# EAGLE design Joysticks_connection_unit (EAGLE 6.3)
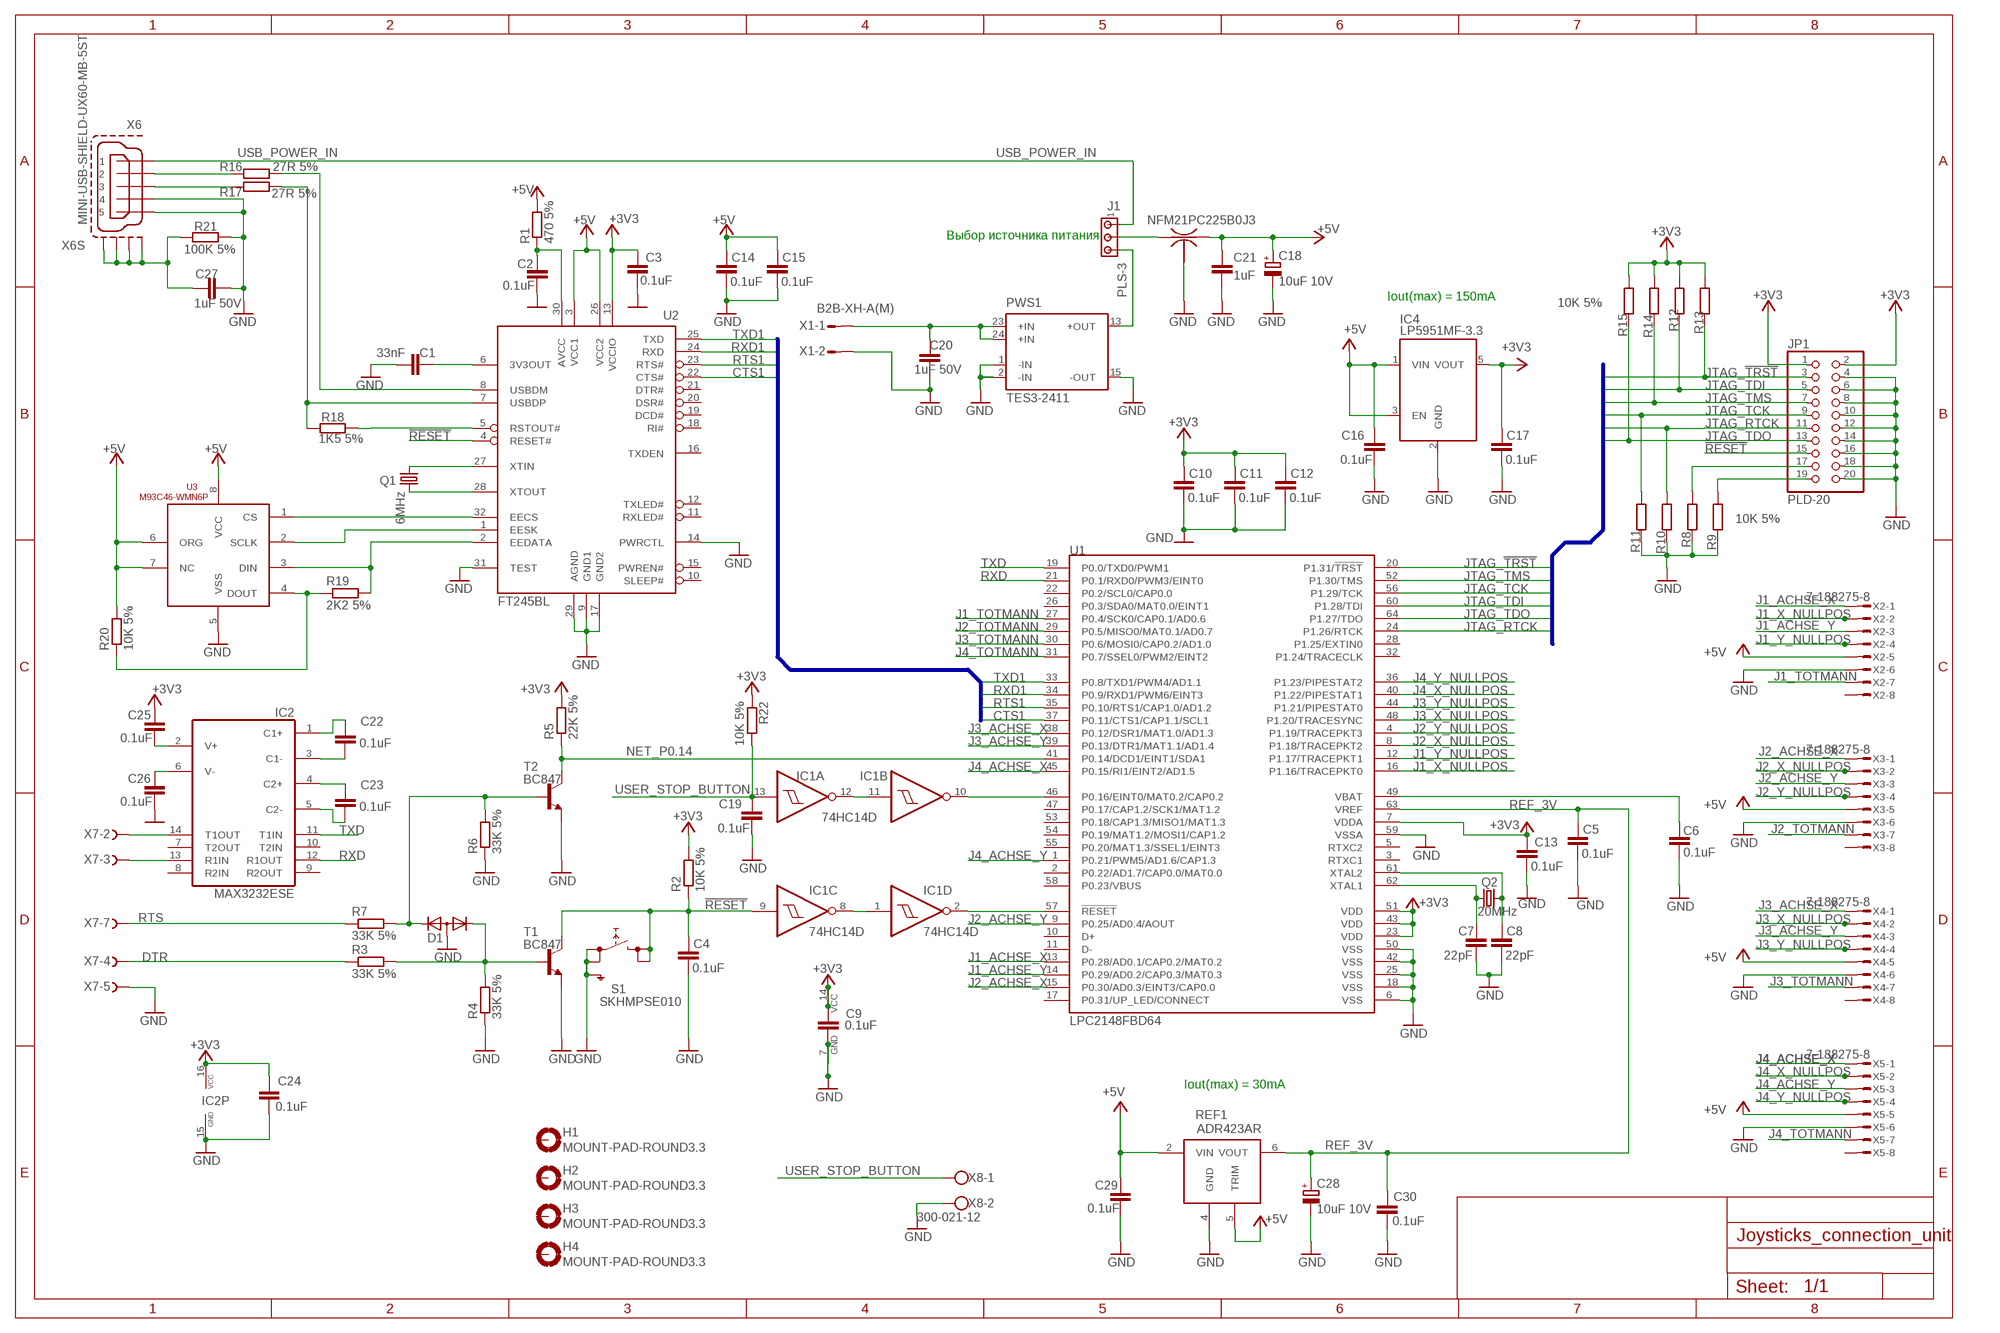
[diagram p0: schematic, sheet 1]

## Parts
C1  33nF  C-EUC0805  [C0805]
C2  0.1uF  C-EUC0805  [C0805]
C3  0.1uF  C-EUC0805  [C0805]
C4  0.1uF  C-EUC0805  [C0805]
C5  0.1uF  C-EUC0805  [C0805]
C6  0.1uF  C-EUC0805  [C0805]
C7  22pF  C-EUC0805  [C0805]
C8  22pF  C-EUC0805  [C0805]
C9  0.1uF  C-EUC0805  [C0805]
C10  0.1uF  C-EUC0805  [C0805]
C11  0.1uF  C-EUC0805  [C0805]
C12  0.1uF  C-EUC0805  [C0805]
C13  0.1uF  C-EUC0805  [C0805]
C14  0.1uF  C-EUC0805  [C0805]
C15  0.1uF  C-EUC0805  [C0805]
C16  0.1uF  C-EUC0805  [C0805]
C17  0.1uF  C-EUC0805  [C0805]
C18  10uF 10V  CPOL-EUSMCB  [SMC_B]
C19  0.1uF  C-EUC0805  [C0805]
C20  1uF 50V  C-EUC0805  [C0805]
C21  1uF  C-EUC0805  [C0805]
C22  0.1uF  C-EUC0805  [C0805]
C23  0.1uF  C-EUC0805  [C0805]
C24  0.1uF  C-EUC0805  [C0805]
C25  0.1uF  C-EUC0805  [C0805]
C26  0.1uF  C-EUC0805  [C0805]
C27  1uF 50V  C-EUC0805  [C0805]
C28  10uF 10V  CPOL-EUSMCB  [SMC_B]
C29  0.1uF  C-EUC0805  [C0805]
C30  0.1uF  C-EUC0805  [C0805]
CF1  NFM21PC225B0J3  NFM21C  [NFM21C]
D1  DIODE-2CA|ACSOT23  [SOT23]
H1  MOUNT-PAD-ROUND3.3  [3,3-PAD]
H2  MOUNT-PAD-ROUND3.3  [3,3-PAD]
H3  MOUNT-PAD-ROUND3.3  [3,3-PAD]
H4  MOUNT-PAD-ROUND3.3  [3,3-PAD]
IC1  74HC14D  [SO14]
IC2  MAX3232ESE  [SO16]
IC4  LP5951MF-3.3  [SOT23-5(MF05A)]
J1  PLS-3  MTA03-100  [10X03MTA]
JP1  PLD-20  PINHD-2X10  [2X10]
PWS1  TES3-2411  [TES3]
Q1  6MHz  CRYSTALHC49S  [HC49/S]
Q2  20MHz  CRYSTALHC49S  [HC49/S]
R1  470 5%  R-EU_R0805  [R0805]
R2  10K 5%  R-EU_R0805  [R0805]
R3  33K 5%  R-EU_R0805  [R0805]
R4  33K 5%  R-EU_R0805  [R0805]
R5  22K 5%  R-EU_R0805  [R0805]
R6  33K 5%  R-EU_R0805  [R0805]
R7  33K 5%  R-EU_R0805  [R0805]
R8  10K 5%  R-EU_R0805  [R0805]
R9  10K 5%  R-EU_R0805  [R0805]
R10  10K 5%  R-EU_R0805  [R0805]
R11  10K 5%  R-EU_R0805  [R0805]
R12  10K 5%  R-EU_R0805  [R0805]
R13  10K 5%  R-EU_R0805  [R0805]
R14  10K 5%  R-EU_R0805  [R0805]
R15  10K 5%  R-EU_R0805  [R0805]
R16  27R 5%  R-EU_R0805  [R0805]
R17  27R 5%  R-EU_R0805  [R0805]
R18  1K5 5%  R-EU_R0805  [R0805]
R19  2K2 5%  R-EU_R0805  [R0805]
R20  10K 5%  R-EU_R0805  [R0805]
R21  100K 5%  R-EU_R0805  [R0805]
R22  10K 5%  R-EU_R0805  [R0805]
REF1  ADR423AR  [SOIC8]
S1  SKHMPSE010  [SKHMPXE010]
T1  BC847  [SOT23]
T2  BC847  [SOT23]
U1  LPC2148FBD64  [TSQFP50P1200X1200X160-64N]
U2  FT245BL  [LQFP32]
U3  M93C46-WMN6P  [SO8]
X1  B2B-XH-A(M)  [B2B-XH-AM]
X2  7-188275-8  MICROMATCH-8SMF  [MMT-F-SMD-8]
X3  7-188275-8  MICROMATCH-8SMF  [MMT-F-SMD-8]
X4  7-188275-8  MICROMATCH-8SMF  [MMT-F-SMD-8]
X5  7-188275-8  MICROMATCH-8SMF  [MMT-F-SMD-8]
X6  MINI-USB-SHIELD-UX60-MB-5ST  [UX60-MB-5ST]
X7  F09VPS  [F09VP]
X8  300-021-12  W237-102  [W237-102]

## Nets
!RESET: C4.1 IC1.9(C:I) JP1.15 R2.1 S1.3(2.1) S1.4(2.2) T1.3(C) U2.4(RESET#)
+3V3: C3.1 C9.1 C10.1 C11.1 C12.1 C13.1 C17.1 C24.1 C25.1 IC1.14(P:VCC) IC2.16(VCC) IC4.5(VOUT) JP1.1 JP1.2 R2.2 R5.2 R12.2 R13.2 R14.2 R15.2 R22.1 U1.7(VDDA) U1.23(VDD) U1.43(VDD) U1.51(VDD) U2.13(VCCIO)
+5V: C14.1 C15.1 C16.1 C18.+ C21.1 C29.1 CF1.3 IC4.1(VIN) IC4.3(EN) R1.2 R20.2 REF1.2(VIN) REF1.5(TRIM) U2.3(VCC1) U2.26(VCC2) U3.6(ORG) U3.7(NC) U3.8(VCC) X2.5 X3.5 X4.5 X5.5
CTS1: U1.37(P0.11/CTS1/CAP1.1/SCL1) U2.22(CTS#)
DTR: R3.1 X7.4
GND: C1.2 C2.2 C3.2 C4.2 C5.2 C6.2 C7.2 C8.2 C9.2 C10.2 C11.2 C12.2 C13.2 C14.2 C15.2 C16.2 C17.2 C18.- C19.2 C20.2 C21.2 C24.2 C26.2 C27.2 C28.- C29.2 C30.2 CF1.2@1 D1.3(A) IC1.7(P:GND) IC2.15(GND) IC4.2(GND) JP1.4 JP1.6 JP1.8 JP1.10 JP1.12 JP1.14 JP1.16 JP1.18 JP1.20 PWS1.1(-IN) PWS1.2(-IN) PWS1.15(-OUT) R4.1 R6.1 R8.1 R9.1 R10.1 R11.1 R21.2 REF1.4(GND) S1.1(1.1) S1.2(1.2) S1.5(SH) T1.2(E) T2.2(E) U1.6(VSS) U1.18(VSS) U1.25(VSS) U1.42(VSS) U1.50(VSS) U1.59(VSSA) U2.9(GND1) U2.14(PWRCTL) U2.17(GND2) U2.29(AGND) U2.31(TEST) U3.5(VSS) X1.2 X2.6 X3.6 X4.6 X5.6 X6.4 X6.5 X7.5 X8.2
J1_ACHSE_X: U1.13(P0.28/AD0.1/CAP0.2/MAT0.2) X2.1
J1_ACHSE_Y: U1.14(P0.29/AD0.2/CAP0.3/MAT0.3) X2.3
J1_TOTMANN: U1.27(P0.4/SCK0/CAP0.1/AD0.6) X2.7
J1_X_NULLPOS: U1.16(P1.16/TRACEPKT0) X2.2
J1_Y_NULLPOS: U1.12(P1.17/TRACEPKT1) X2.4
J2_ACHSE_X: U1.15(P0.30/AD0.3/EINT3/CAP0.0) X3.1
J2_ACHSE_Y: U1.9(P0.25/AD0.4/AOUT) X3.3
J2_TOTMANN: U1.29(P0.5/MISO0/MAT0.1/AD0.7) X3.7
J2_X_NULLPOS: U1.8(P1.18/TRACEPKT2) X3.2
J2_Y_NULLPOS: U1.4(P1.19/TRACEPKT3) X3.4
J3_ACHSE_X: U1.38(P0.12/DSR1/MAT1.0/AD1.3) X4.1
J3_ACHSE_Y: U1.39(P0.13/DTR1/MAT1.1/AD1.4) X4.3
J3_TOTMANN: U1.30(P0.6/MOSI0/CAP0.2/AD1.0) X4.7
J3_X_NULLPOS: U1.48(P1.20/TRACESYNC) X4.2
J3_Y_NULLPOS: U1.44(P1.21/PIPESTAT0) X4.4
J4_ACHSE_X: U1.45(P0.15/RI1/EINT2/AD1.5) X5.1
J4_ACHSE_Y: U1.1(P0.21/PWM5/AD1.6/CAP1.3) X5.3
J4_TOTMANN: U1.31(P0.7/SSEL0/PWM2/EINT2) X5.7
J4_X_NULLPOS: U1.40(P1.22/PIPESTAT1) X5.2
J4_Y_NULLPOS: U1.36(P1.23/PIPESTAT2) X5.4
JTAG_!TRST: JP1.3 R13.1 U1.20(P1.31/!TRST)
JTAG_RTCK: JP1.11 R10.2 U1.24(P1.26/RTCK)
JTAG_TCK: JP1.9 R11.2 U1.56(P1.29/TCK)
JTAG_TDI: JP1.5 R12.1 U1.60(P1.28/TDI)
JTAG_TDO: JP1.13 R15.1 U1.64(P1.27/TDO)
JTAG_TMS: JP1.7 R14.1 U1.52(P1.30/TMS)
N$1: C2.1 R1.1 U2.30(AVCC)
N$2: C1.1 U2.6(3V3OUT)
N$3: IC1.1(D:I) IC1.8(C:O)
N$4: JP1.19 R9.2
N$5: C20.1 PWS1.23(+IN) PWS1.24(+IN) X1.1
N$6: C6.1 U1.49(VBAT)
N$7: D1.1(K1) R3.2 R4.2 T1.1(B)
N$8: JP1.17 R8.2
N$9: C7.1 Q2.1 U1.62(XTAL1)
N$10: C8.1 Q2.2 U1.61(XTAL2)
N$12: Q1.2 U2.28(XTOUT)
N$13: Q1.1 U2.27(XTIN)
N$14: R16.1 X6.2
N$15: R17.1 X6.3
N$16: R17.2 R18.1 U2.7(USBDP)
N$17: R16.2 U2.8(USBDM)
N$18: R18.2 U2.5(RSTOUT#)
N$19: U2.32(EECS) U3.1(CS)
N$20: U2.1(EESK) U3.2(SCLK)
N$21: R19.2 U2.2(EEDATA) U3.3(DIN)
N$22: R19.1 R20.1 U3.4(DOUT)
N$23: J1.3 PWS1.13(+OUT)
N$24: IC1.11(B:I) IC1.12(A:O)
N$26: IC1.2(D:O) U1.57(!RESET)
N$27: IC1.10(B:O) U1.46(P0.16/EINT0/MAT0.2/CAP0.2)
N$28: CF1.1 J1.2
N$29: C22.2 IC2.3(C1-)
N$30: C22.1 IC2.1(C1+)
N$31: C23.1 IC2.4(C2+)
N$32: C23.2 IC2.5(C2-)
N$33: C25.2 IC2.2(V+)
N$34: C26.1 IC2.6(V-)
N$35: IC2.14(T1OUT) X7.2
N$36: IC2.13(R1IN) X7.3
N$37: D1.2(K2) R6.2 R7.2 T2.1(B)
N$38: C27.1 R21.1 X6.M1(S1) X6.M2(S2) X6.M3(S3) X6.M4(S4)
NET_P0.14: R5.1 T2.3(C) U1.41(P0.14/DCD1/EINT1/SDA1)
REF_3V: C5.1 C28.+ C30.1 REF1.6(VOUT) U1.63(VREF)
RTS: R7.1 X7.7
RTS1: U1.35(P0.10/RTS1/CAP1.0/AD1.2) U2.23(RTS#)
RXD: IC2.12(R1OUT) U1.21(P0.1/RXD0/PWM3/EINT0)
RXD1: U1.34(P0.9/RXD1/PWM6/EINT3) U2.24(RXD)
TXD: IC2.11(T1IN) U1.19(P0.0/TXD0/PWM1)
TXD1: U1.33(P0.8/TXD1/PWM4/AD1.1) U2.25(TXD)
USB_POWER_IN: J1.1 X6.1
USER_STOP_BUTTON: C19.1 IC1.13(A:I) R22.2 X8.1
Unconnected: CF1.2@2 H1.B3,3(MOUNT) H2.B3,3(MOUNT) H3.B3,3(MOUNT) H4.B3,3(MOUNT) IC1.3(E:I) IC1.4(E:O) IC1.5(F:I) IC1.6(F:O) IC2.7(T2OUT) IC2.8(R2IN) IC2.9(R2OUT) IC2.10(T2IN) U1.2(P0.22/AD1.7/CAP0.0/MAT0.0) U1.3(RTXC1) U1.5(RTXC2) U1.10(D+) U1.11(D-) U1.17(P0.31/UP_LED/CONNECT) U1.22(P0.2/SCL0/CAP0.0) U1.26(P0.3/SDA0/MAT0.0/EINT1) U1.28(P1.25/EXTIN0) U1.32(P1.24/TRACECLK) U1.47(P0.17/CAP1.2/SCK1/MAT1.2) U1.53(P0.18/CAP1.3/MISO1/MAT1.3) U1.54(P0.19/MAT1.2/MOSI1/CAP1.2) U1.55(P0.20/MAT1.3/SSEL1/EINT3) U1.58(P0.23/VBUS) U2.10(SLEEP#) U2.11(RXLED#) U2.12(TXLED#) U2.15(PWREN#) U2.16(TXDEN) U2.18(RI#) U2.19(DCD#) U2.20(DSR#) U2.21(DTR#) X2.8 X3.8 X4.8 X5.8 X7.1 X7.6 X7.8 X7.9

## Buses
JTAG_TMS,JTAG_TCK,JTAG_!TRST,JTAG_TDI,JTAG_TDO,JTAG_RTCK
TXD1,RXD1,RTS1,CTS1

## Notes on the sheet
- Выбор источника питания
- Iout(max) = 150mA
- Iout(max) = 30mA

## Library data of the parts
C1-C17 C19-C27 C29 C30 = rcl:C-EU: CAPACITOR, European symbol
C18 C28 = rcl:CPOL-EU: POLARIZED CAPACITOR, European symbol
CF1 = murata-filter:NFM: EMIFIL(R) (Capacitor type) Single Circuit Type for Signal Lines Source: http://search.murata.co.jp/Ceramy/image/img/PDF/ENG/L0111S0109NFM3DC.pdf; MPN: NFM21CC102R1H3D; OC_FARNELL: 1828795; OC_NEWARK: 84R0165
D1 = diode:DIODE-2CA|AC: Dual DIODE Cathode-Anode|Anode-Cathode
H1-H4 = holes:MOUNT-PAD-ROUND: MOUNTING PAD, round
IC1 = 74xx-eu:74*14: Hex schmitt trigger INVERTER
IC2 = maxim:MAX3232*: True RS-232 Transceivers 3.0V to 5.5V, Low-Power up to 1Mbps, Using Four 0.1µF External Capacitors Source: http://pdfserv.maxim-ic.com/en/ds/MAX3222-MAX3241.pdf; MF: MAXIM; MPN: MAX3232ESE; OC_FARNELL: 9725539; OC_NEWARK: 79C3880
IC4 = my_components:LP5951MF-3.3: 150mA Low-Dropout CMOS Voltage Regulator Source: http://www.ti.com/lit/ds/symlink/lp5951.pdf
J1 = con-amp:MTA03-100: AMP connector
JP1 = pinhead:PINHD-2X10: PIN HEADER
PWS1 = traco-electronic:TES3: DC/DC Converter Single Output, 3W Source: Data sheet <http://www.tracopower.com/datasheet_g/tes3-d.pdf>
Q1 Q2 = crystal:CRYSTAL: CRYSTAL; OC_FARNELL: 1667008; OC_NEWARK: unknown
R1-R22 = rcl:R-EU_: RESISTOR, European symbol
REF1 = my_components:ADR423AR: Precision Micropower, Low Dropout, Voltage References Low self-supply current: 45 uA max Voltage Output: 3.0 Volts High Output Current: 30 mA Short Circuit Protection
S1 = switch:SKHMP*E010: 6.2 X 6.5mm TACT Switch (SMD) Source: http://www3.alps.co.jp/WebObjects/catalog.woa/PDF/E/Switch/Tact/SKHM/SKHM.PDF
T1 T2 = transistor:BC847: NPN TRANSISTOR
U1 = philips-5:LPC2148
U2 = ftdichip-5:FT245BL: USB FIFO 2nd Generation USB FIFO (USB <-> Parallel) Controller
U3 = my_components:M93C46-WMN6P: 1 Kbit MICROWIRE® serial access EEPROM http://www.st.com/internet/com/TECHNICAL_RESOURCES/TECHNICAL_LITERATURE/DATASHEET/CD00001142.pdf
X1 = my_components:B2B-XH-A(M): B2B-XH-A(M) Top entry type, 2.5 mm, 2 pin 1 row
X2-X5 = con-amp-micromatch:MICROMATCH-8: MicroMaTch 8 7-215464-8 / 0-215464-8 Drawing Number C-215464 DDEController.pdf
X6 = con-hirose:MINI-USB-SHIELD-: MINI USB Connector Source: http://www.hirose.co.jp/cataloge_hp/e24000019.pdf; OC_FARNELL: unknown; OC_NEWARK: unknown
X7 = con-subd:F09?S: SUB-D; OC_FARNELL: unknown; OC_NEWARK: unknown
X8 = con-wago-500:W237-102: WAGO SCREW CLAMP; MPN: 237-102; OC_FARNELL: unknown; OC_NEWARK: 70K9898

## Board
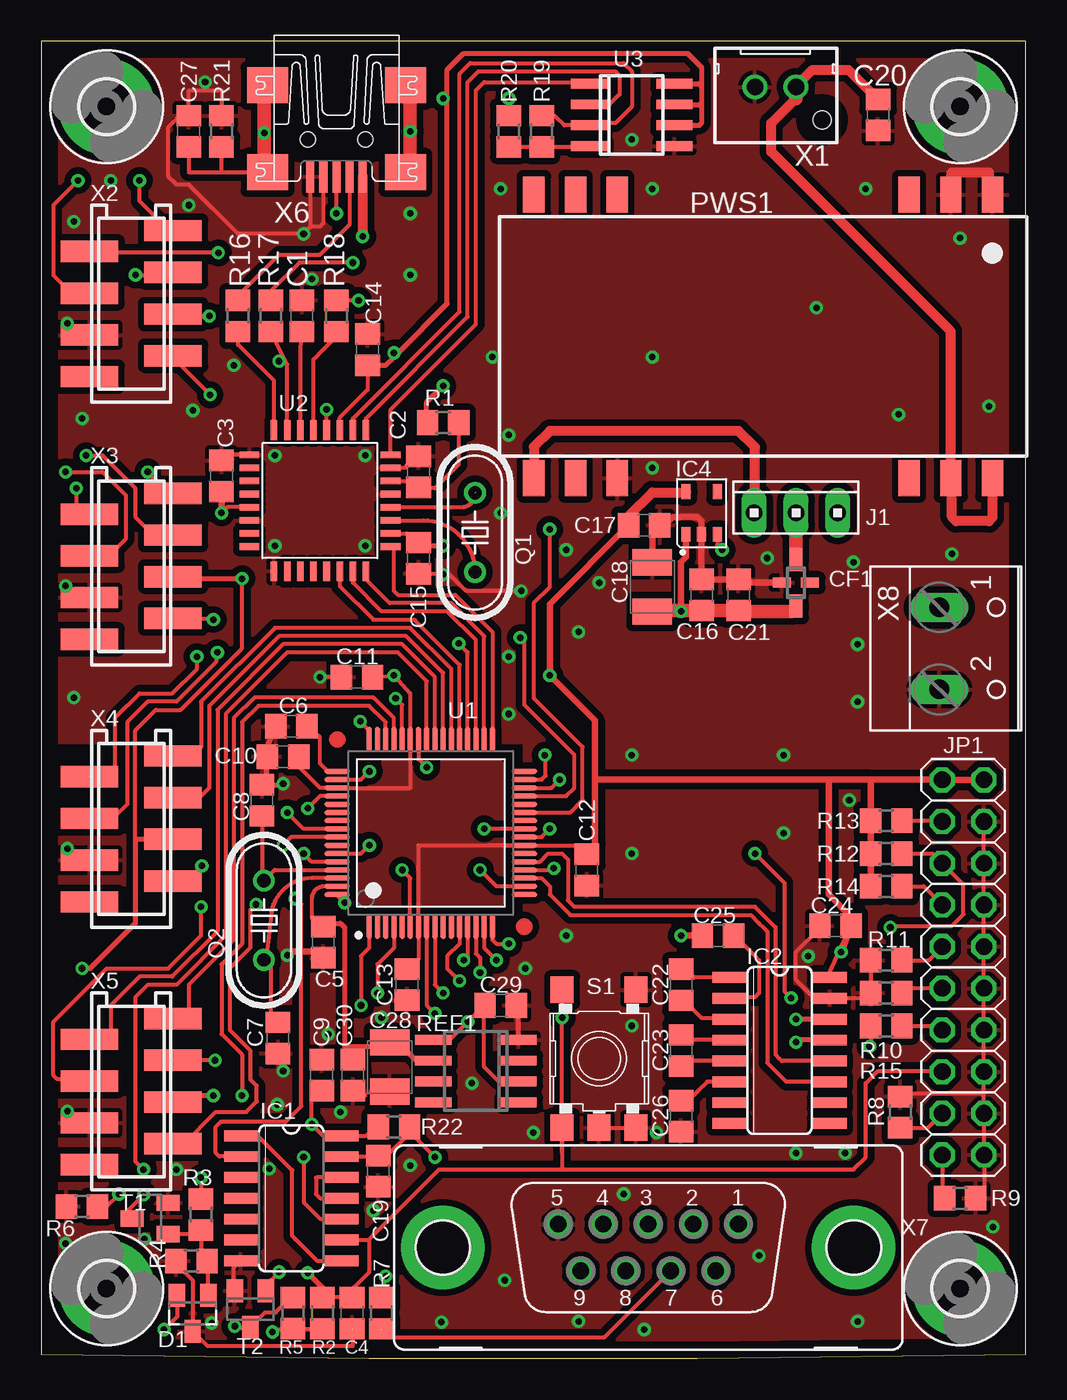
[diagram p1: board, top side]
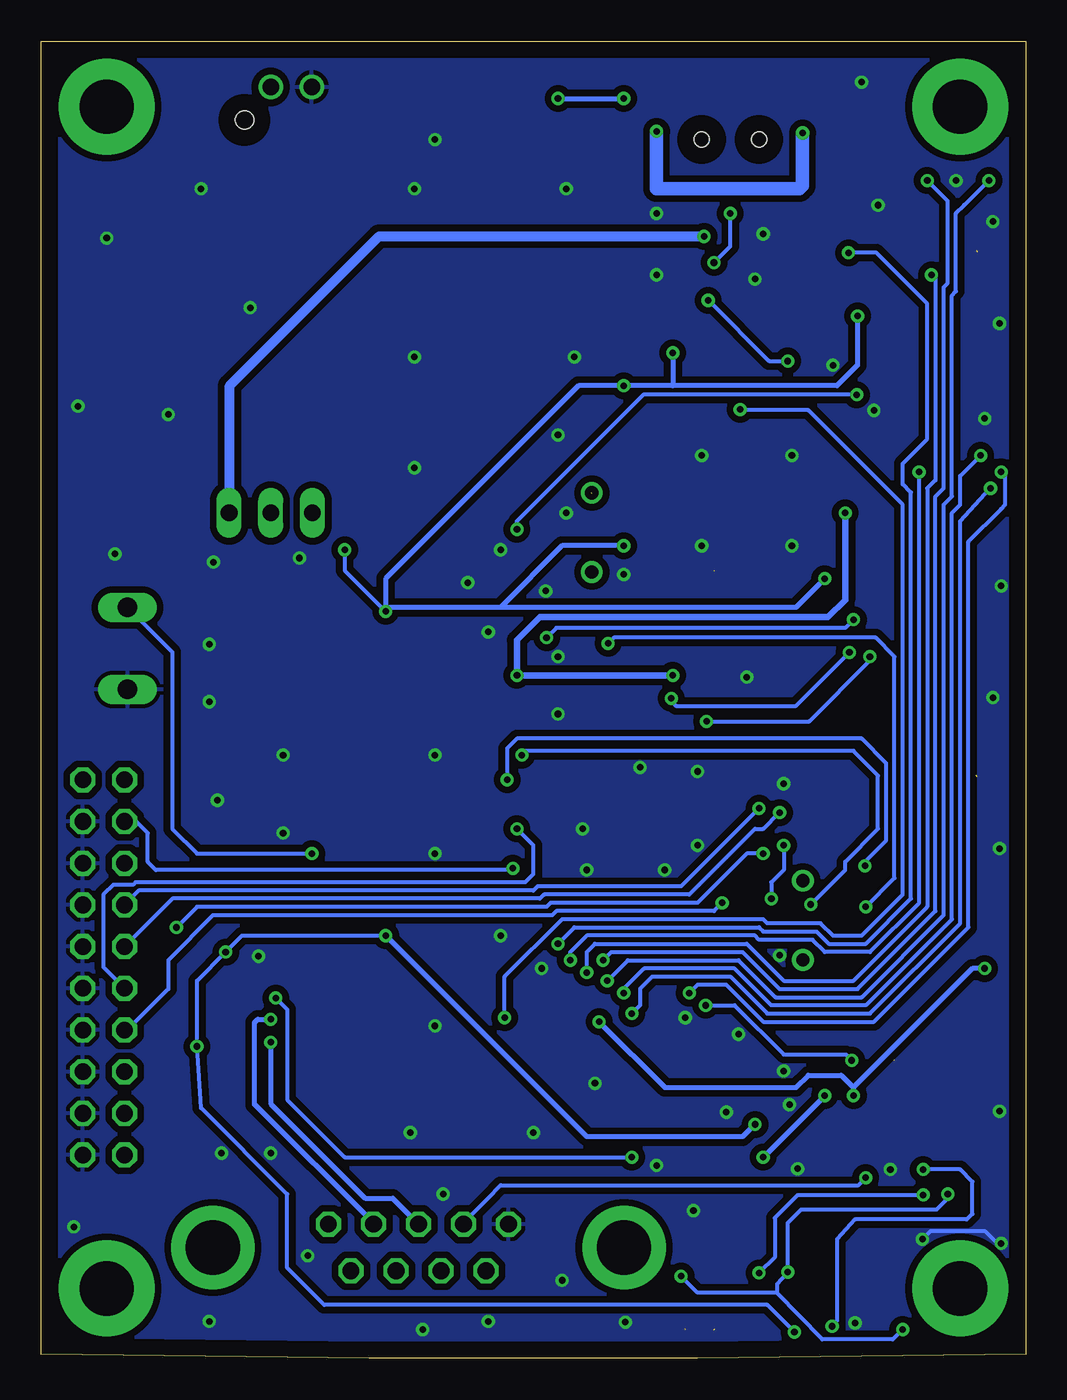
[diagram p2: board, bottom side, seen from below]

Size 60 x 80.26 mm. Coordinates in mm from the lower left corner, seen from the top.
Outline: 0,80.26 0,0.26 arc2 60,0.26 60,80.26 0,80.26
Copper layers (1*16): Top 0.035mm / dielectric 1.5mm / Bottom 0.035mm
Design rules "default *": minimum track width 10mil, minimum drill 0.4mm, track to track 0.23mm, track to pad 0.2mm, pad to pad 0.2mm, via to via 0.22mm, smd to smd 0mil, copper to edge 40mil, drill to drill 8mil, minimum pad ring 10mil, minimum via ring 0.2mm, stop-mask expansion 4mil, vias tented up to drill 0.5mm, thermal gap 10mil

### Footprints (pad centres in the part's own frame; a part is rotated, then mirrored left to right if it is on the bottom)
C0805 = smd 1.3 x 1.5: 1 -0.95,0; 2 0.95,0
SMC_B = smd 1.6 x 2.4: + -1.5,0; - 1.5,0
NFM21C = smd 1.4 x 0.8: 1 -1.425,0; 3 1.425,0 | smd 0.6 x 1.1: 2@1 0,-0.85; 2@2 0,0.85
SOT23 = smd 1 x 1.4: 1 -0.95,-1.1; 2 0.95,-1.1; 3 0,1.1
3,3-PAD = drill 3.3 pad 5.842: B3,3 0,0
SO14 = smd 0.66 x 2.032: 1 -3.81,-3.073; 2 -2.54,-3.073; 3 -1.27,-3.073; 4 0,-3.073; 5 1.27,-3.073; 6 2.54,-3.073; 7 3.81,-3.073; 8 3.81,3.073; 9 2.54,3.073; 10 1.27,3.073; 11 0,3.073; 12 -1.27,3.073; 13 -2.54,3.073; 14 -3.81,3.073
SO16 = smd 0.66 x 2.032: 1 -4.445,-3.073; 2 -3.175,-3.073; 3 -1.905,-3.073; 4 -0.635,-3.073; 5 0.635,-3.073; 6 1.905,-3.073; 7 3.175,-3.073; 8 4.445,-3.073; 9 4.445,3.073; 10 3.175,3.073; 11 1.905,3.073; 12 0.635,3.073; 13 -0.635,3.073; 14 -1.905,3.073; 15 -3.175,3.073; 16 -4.445,3.073
SOT23-5(MF05A) = smd 0.55 x 0.9: 1 -0.953,-1.295; 2 0,-1.295; 3 0.953,-1.295; 4 0.953,1.295; 5 -0.953,1.295
10X03MTA = drill 1.016 long: 1 2.54,0; 2 0,0; 3 -2.54,0
2X10 = drill 1.016 octagon: 1 -11.43,-1.27; 2 -11.43,1.27; 3 -8.89,-1.27; 4 -8.89,1.27; 5 -6.35,-1.27; 6 -6.35,1.27; 7 -3.81,-1.27; 8 -3.81,1.27; 9 -1.27,-1.27; 10 -1.27,1.27; 11 1.27,-1.27; 12 1.27,1.27; 13 3.81,-1.27; 14 3.81,1.27; 15 6.35,-1.27; 16 6.35,1.27; 17 8.89,-1.27; 18 8.89,1.27; 19 11.43,-1.27; 20 11.43,1.27
TES3 = smd 1.3 x 2.2: 1 -13.97,-8.636; 2 -11.43,-8.636; 3 -8.89,-8.636; 10 8.89,-8.636; 11 11.43,-8.636; 12 13.97,-8.636; 13 13.97,8.636; 14 11.43,8.636; 15 8.89,8.636; 22 -8.89,8.636; 23 -11.43,8.636; 24 -13.97,8.636
HC49/S = drill 0.813: 1 -2.413,0; 2 2.413,0
R0805 = smd 1.3 x 1.5: 1 -0.95,0; 2 0.95,0
SOIC8 = smd 0.6 x 2.2: 1 -1.905,-2.6; 2 -0.635,-2.6; 3 0.635,-2.6; 4 1.905,-2.6; 5 1.905,2.6; 6 0.635,2.6; 7 -0.635,2.6; 8 -1.905,2.6
SKHMPXE010 = smd 1.6 x 1.4: 1 -4.2,2.25; 2 4.2,2.25; 3 -4.2,-2.25; 4 4.2,-2.25; 5 4.2,0
TSQFP50P1200X1200X160-64N = smd 1.55 x 0.3: 1 -5.7,3.75; 2 -5.7,3.25; 3 -5.7,2.75; 4 -5.7,2.25; 5 -5.7,1.75; 6 -5.7,1.25; 7 -5.7,0.75; 8 -5.7,0.25; 9 -5.7,-0.25; 10 -5.7,-0.75; 11 -5.7,-1.25; 12 -5.7,-1.75; 13 -5.7,-2.25; 14 -5.7,-2.75; 15 -5.7,-3.25; 16 -5.7,-3.75; 33 5.7,-3.75; 34 5.7,-3.25; 35 5.7,-2.75; 36 5.7,-2.25; 37 5.7,-1.75; 38 5.7,-1.25; 39 5.7,-0.75; 40 5.7,-0.25; 41 5.7,0.25; 42 5.7,0.75; 43 5.7,1.25; 44 5.7,1.75; 45 5.7,2.25; 46 5.7,2.75; 47 5.7,3.25; 48 5.7,3.75 | smd 0.3 x 1.55: 17 -3.75,-5.7; 18 -3.25,-5.7; 19 -2.75,-5.7; 20 -2.25,-5.7; 21 -1.75,-5.7; 22 -1.25,-5.7; 23 -0.75,-5.7; 24 -0.25,-5.7; 25 0.25,-5.7; 26 0.75,-5.7; 27 1.25,-5.7; 28 1.75,-5.7; 29 2.25,-5.7; 30 2.75,-5.7; 31 3.25,-5.7; 32 3.75,-5.7; 49 3.75,5.7; 50 3.25,5.7; 51 2.75,5.7; 52 2.25,5.7; 53 1.75,5.7; 54 1.25,5.7; 55 0.75,5.7; 56 0.25,5.7; 57 -0.25,5.7; 58 -0.75,5.7; 59 -1.25,5.7; 60 -1.75,5.7; 61 -2.25,5.7; 62 -2.75,5.7; 63 -3.25,5.7; 64 -3.75,5.7
LQFP32 = smd 0.4 x 1.2: 1 -2.8,-4.3; 2 -2,-4.3; 3 -1.2,-4.3; 4 -0.4,-4.3; 5 0.4,-4.3; 6 1.2,-4.3; 7 2,-4.3; 8 2.8,-4.3; 17 2.8,4.3; 18 2,4.3; 19 1.2,4.3; 20 0.4,4.3; 21 -0.4,4.3; 22 -1.2,4.3; 23 -2,4.3; 24 -2.8,4.3 | smd 1.2 x 0.4: 9 4.3,-2.8; 10 4.3,-2; 11 4.3,-1.2; 12 4.3,-0.4; 13 4.3,0.4; 14 4.3,1.2; 15 4.3,2; 16 4.3,2.8; 25 -4.3,2.8; 26 -4.3,2; 27 -4.3,1.2; 28 -4.3,0.4; 29 -4.3,-0.4; 30 -4.3,-1.2; 31 -4.3,-2; 32 -4.3,-2.8
SO8 = smd 0.6 x 2.2: 1 -1.905,-2.6; 2 -0.635,-2.6; 3 0.635,-2.6; 4 1.905,-2.6; 5 1.905,2.6; 6 0.635,2.6; 7 -0.635,2.6; 8 -1.905,2.6
B2B-XH-AM = drill 1 pad 1.5: 1 -1.25,0; 2 1.25,0 | hole 1.1: -2.85,2; -2.85,2
MMT-F-SMD-8 = smd 1.3 x 3.5: 1 4.445,-2.54; 2 3.175,2.54; 3 1.905,-2.54; 4 0.635,2.54; 5 -0.635,-2.54; 6 -1.905,2.54; 7 -3.175,-2.54; 8 -4.445,2.54
UX60-MB-5ST = smd 2 x 0.5: 1 2.25,1.6; 2 2.25,0.8; 3 2.25,0; 4 2.25,-0.8; 5 2.25,-1.6 | smd 2.2 x 2.5: M1 -3.3,-4.2; M2 -3.3,4.2; M3 2,4.2; M4 2,-4.2 | hole 0.9: 0,-1.75; 0,1.75
F09VP = drill 1.016 octagon: 1 5.486,1.422; 2 2.743,1.422; 3 0,1.422; 4 -2.743,1.422; 5 -5.486,1.422; 6 4.115,-1.422; 7 1.372,-1.422; 8 -1.372,-1.422; 9 -4.115,-1.422 | drill 3.302 pad 5.08: G1 -12.522,0; G2 12.522,0
W237-102 = drill 1.194 long: 1 -2.5,-1.27; 2 2.5,-1.27

### Placement (x,y rotation side)
C1  15.9,63.51 90 top
C2  23,54.01 90 top
C3  11,53.76 90 top
C4  18.95,2.76 270 top
C5  17.2,25.36 270 top
C6  15.25,38.51 180 top
C7  14.44,19.52 270 top
C8  13.46,34 90 top
C9  17.1,17.26 90 top
C10  14.75,36.66 180 top
C11  19.25,41.51 180 top
C12  33.25,29.76 270 top
C13  22.3,22.77 270 top
C14  19.9,61.46 90 top
C15  23,48.76 270 top
C16  40.25,46.51 90 top
C17  36.75,50.76 0 top
C18  37.25,47.01 90 top
C19  20.55,11.41 270 top
C20  51,75.76 270 top
C21  42.5,46.51 90 top
C22  39,22.76 270 top
C23  39,18.76 270 top
C24  48.4,26.36 180 top
C25  41.25,25.76 0 top
C26  39,14.76 270 top
C27  9,74.76 90 top
C28  21.25,17.76 270 top
C29  28,21.51 0 top
C30  19,17.26 270 top
CF1  46,47.26 270 top
D1  9.24,2.75 180 top
H1  4,76.26 270 top
H2  56,76.26 270 top
H3  4,4.26 270 top
H4  56,4.26 270 top
IC1  15.25,9.76 270 top
IC2  45,18.76 270 top
IC4  40.25,51.51 0 top
J1  46,51.51 0 top
JP1  56.18,23.82 270 top
PWS1  44,62.26 180 top
Q1  26.44,50.32 90 top
Q2  13.58,26.69 90 top
R1  24.5,57.01 180 top
R2  17.15,2.76 270 top
R3  9.75,8.76 270 top
R4  9.17,5.94 0 top
R5  15.35,2.77 270 top
R6  2.49,9.26 0 top
R7  20.75,2.76 90 top
R8  52.35,15.01 270 top
R9  56,9.76 180 top
R10  51.5,22.26 0 top
R11  51.5,24.26 0 top
R12  51.5,30.76 180 top
R13  51.5,32.76 180 top
R14  51.5,28.76 180 top
R15  51.5,20.26 180 top
R16  12,63.51 270 top
R17  14,63.51 270 top
R18  18,63.51 270 top
R19  30.5,74.76 90 top
R20  28.5,74.76 90 top
R21  11,74.76 90 top
R22  21.5,14.11 0 top
REF1  26.5,17.51 90 top
S1  34,18.26 270 top
T1  6.66,8.53 90 top
T2  12.75,3.01 180 top
U1  23.75,32.01 90 top
U2  17,52.26 180 top
U3  36,75.76 270 top
X1  44.75,77.46 180 top
X2  5.5,64.26 90 top
X3  5.5,48.26 90 top
X4  5.5,32.26 90 top
X5  5.5,16.26 90 top
X6  18,74.26 270 top
X7  37,6.76 0 top
X8  56,43.26 270 top

### Tracks (layer width: path | path; a pad name or v marks a point on that pad's centre or on a via)
!RESET  (via drill 0.4)
  Top 0.254: U2.4 v17.4,57.81 | S1.4 v31.75,20.76 | 20,7.26 20,5.26 19,4.26 18.8,3.76 C4.1 R2.1 17.13,3.71 | 20,7.26 24.25,11.51 31.75,11.51 | 31.75,12.51 S1.4 | T1.3 5.33,8.76 5.33,9.04 v6.25,9.96 | IC1.9 19.96,7.22 20,7.26 | S1.4 31.75,11.51 | 31.75,11.51 49.5,11.51 50.25,12.26 50.25,16.76 51,17.51 54.87,17.51 JP1.15
  Top 0.305: S1.3 v31.75,20.76 | v16.25,5.21 17.15,4.31 R2.1
  Bottom 0.254: 16.05,5.21 v16.25,5.21 15.3,6.16 15.3,8.56 13.9,9.96 v6.25,9.96 | v31.75,20.76 31.75,23.26 28.25,26.76 16,26.76 15.75,26.51 12.5,26.51 11.75,25.76 10,25.76 7.5,28.26 7.5,52.01 13.25,57.76 17.35,57.76 v17.4,57.81
+3V3  (via drill 0.4)
  Top 0.254: U1.23 27.25,31.26 | U2.13 11.35,51.86 v11,51.51 | U1.23 33,31.26 C12.1 | C10.1 15.75,36.71 15.75,36.01 17,34.76 U1.51 22.5,34.76 U1.43 22.5,40.51 v21.5,41.61 C11.1 | R5.2 R2.2 | R2.2 | C24.1 47.95,23.33 IC2.16 | IC1.14 19.81,13.57 20.35,14.11 R22.1 | 17.3,16.31 C9.1 16.5,16.31 v16.5,14.26 17.19,13.57 17.59,13.57 | 22.09,23.51 C13.1 23,24.32 U1.7 23,31.26 U1.23 | R15.2 50.55,19.21 v50.5,19.01 | R2.2 17.08,1.76 14.25,1.76 v14.1,1.61
  Top 0.305: IC1.14 17.59,13.57
  Top 0.406: R14.2 R12.2 R13.2 50.55,35.21 50.5,35.26 | 50.5,35.26 JP1.1 JP1.2 | C17.1 31,45.96 v31,41.61 33.75,38.86 33.75,35.26 | C3.1 v11,51.51 | 50.5,35.26 48,35.26 | 48,35.26 33.75,35.26 | 48,35.26 48,28.26 49.35,26.91 C24.1 v48.75,24.76 | C25.1 v39,25.76 | 33.75,35.26 33.75,31.21 C12.1
  Top 0.61: C17.1 35.8,51.31 37.25,52.76 39.25,52.76 IC4.5
  Bottom 0.254: v14.1,1.61 15.75,3.26 42.75,3.26 45,5.51 45,10.01 50.25,15.26 v50.5,19.01 50.5,23.01 v48.75,24.76 47.75,25.76 v39,25.76
  Bottom 0.305: v16.5,14.26 17.25,13.51 26.75,13.51 v39,25.76
  Bottom 0.406: v21.5,41.61 v31,41.61 31,43.76 29.6,45.16 12.05,45.16 11,46.21 v11,51.51
  pour Top (isolate 0.406): 19.5,36.26 28,36.26 28,27.76 19.5,27.76
+5V  (via drill 0.4)
  Top 0.254: 21.25,50.26 U2.26 22.25,50.26 23,49.51 C15.1 | U2.3 18.2,57.31 19.9,59.01 C14.1 | IC4.3 41.2,49.56 v41.5,49.26 | v39,45.51 38.5,45.51 | 6.38,31.63 5.75,31.66 5.75,38.26 7,39.51 8.5,39.51 12.25,43.26 v12.25,47.51 | 27,21.26 27,21.46 C29.1 | REF1.2 27.89,16.88 27,17.76 27,21.26 | REF1.5 24.91,19.42 v26,20.51 26.75,21.26 27,21.26
  Top 0.305: 23,49.51 v24.5,49.51 | X3.5 8.15,47.51 v12.25,47.51 | X2.5 8.15,63.51 v10.25,63.51 | C14.1 21,60.51 21.5,61.01 v21.5,61.26 21.75,61.26 24.75,64.26 24.75,76.76 | R1.2 23.5,57.06 23.5,58.26 v24.5,59.26 | 24.75,76.76 24.75,78.51 25.75,79.51 39.4,79.51 40.25,78.66 40.25,77.51 | U3.8 40.09,77.67 40.25,77.51 | 40.25,77.51 40.25,76.26 | 40.25,76.26 40.25,75.26 40.12,75.13 U3.6 | U3.7 40.12,76.4 40.25,76.26 | R20.2 v28.5,76.76 | 24.75,76.76 v24.5,76.76 | X4.5 6.38,31.63 5.87,31.63 5.75,31.66 5.75,26.51 3,23.76 v2.5,23.76 | v10.5,16.01 8.18,16.01 X5.5 | 39,45.56 v39,45.51
  Top 0.406: IC4.1 39.3,48.81 39,48.51 39,45.56
  Top 0.813: CF1.3 46,45.76 45.75,45.51 42.55,45.51 C21.1 C16.1 39,45.56 37.3,45.56 C18.+
  Bottom 0.254: v41.5,49.26 41.5,48.01 v39,45.51
  Bottom 0.305: v24.5,49.51 28.25,49.51 32,45.76 | v12.25,47.51 14,45.76 32,45.76 | v10.25,63.51 10.25,60.51 11.5,59.26 21.5,59.26 | 21.5,59.26 v24.5,59.26 27.25,59.26 39,47.51 v39,45.51 38.75,45.76 32,45.76 | v21.5,61.26 21.5,59.26 | v28.5,76.76 v24.5,76.76 | v2.5,23.76 3.25,23.76 10.5,16.51 | v26,20.51 22,16.51 14,16.51 13.25,17.26 11.25,17.26 10.5,16.51 | 10.5,16.51 v10.5,16.01
CTS1
  Top 0.254: U2.22 18.2,47.06 20.25,45.01 22.75,45.01 22.8,44.96 25.5,42.26 U1.37
DTR  (via drill 0.4)
  Top 0.254: v9.75,11.01 R3.1
  Bottom 0.254: X7.4 34.26,8.26 32.75,9.76 32,10.56 10.2,10.56 v9.75,11.01
GND  (via drill 0.4)  (1 unrouted)
  Top 0.254: U2.31 22.15,54.26 22.4,54.51 22.55,54.51 C2.2 | U1.42 23,36.51 v23.5,36.01 | U1.50 19.5,35.26 v20,35.76 | U1.6 22.5,29.26 v22,29.76 | U2.9 11.35,55.06 C3.2 | 11.3,75.71 R21.2 11,77.26 9,77.26 C27.2 8.7,75.71 8.5,75.76 7.75,75.01 7.75,72.01 8.25,71.51 9,71.51 12,68.51 15.95,68.51 16.4,68.96 17,68.96 17.2,69.16 X6.4 | U1.59 19.5,30.76 v20,31.26 | U1.18 27.75,28.76 v26.75,29.76 | C11.2 v17,41.51 | C15.2 24.45,47.81 v24.5,47.76 24.9,47.76 25.9,46.76 v29.25,46.76 | R11.1 R10.1 50.23,21.94 IC2.15 47.12,21.94 46,23.06 46,24.76 47.45,26.21 C24.2 | R9.1 57,9.76 57.5,10.26 57.5,12.34 JP1.20 JP1.18 57.45,16.16 | 57.45,16.16 JP1.16 JP1.14 JP1.12 JP1.10 JP1.8 JP1.6 JP1.4 | T2.2 11.75,4.26 | 11.75,4.26 11.75,5.51 12.25,6.01 | 11.75,4.26 11.75,4.01 | 19,1.76 19,0.76 10.13,0.76 D1.3 | S1.5 S1.2 36.45,14.06 36.5,14.01 36.75,14.26 36.25,14.26 | C7.2 14.74,18.22 v14.75,17.51 | 19.75,16.01 19.75,16.06 C30.2 | U1.25 v27,32.26 | 15.2,24.81 v15,24.56 | R8.1 52.55,16.16 57.45,16.16 | R4.1 8.22,5.79 9.25,4.76 9.25,1.51 | X6.5 16.4,68.91 v16,68.51
  Top 0.305: v14.75,35.01 14.69,34.95 C8.2 13.75,35.24 13.75,36.61 C10.2 13.65,37.01 C6.2 | REF1.4 29.1,21.36 C29.2 | C29.2 29,21.51 | 29.25,21.26 29,21.51 | 29,21.51 29.25,21.51 | C29.2 28.75,21.51
  Top 0.406: CF1.2@1 42.7,47.26 C21.2 C16.2 IC4.2 40.25,51.01 40,51.26 38.5,51.26 38,50.76 C17.2 37.25,50.31 C18.- | 15.2,24.81 17.2,24.81 C5.2
  Top 0.61: PWS1.2 55.43,71.69 55.5,72.26 57.75,72.26 57.75,71.12 PWS1.1
  Bottom 0.254: v24.5,47.76 24.5,47.51 | v6.3,7.26 5.8,7.76 2.5,7.76 1.75,7.01 v1.5,7.01
  other vias: 36,20.26 36,30.76 29.5,23.76 49.75,2.26 43.75,6.26 30,13.76 26.25,16.76 18.25,15.01 14.4,15.46 8.25,11.51 32,25.76 24.4,2.21 1.6,15.06 13.9,11.56 1.6,31.06 1.5,47.06 1.6,63.06 9.25,57.76 14.25,49.51 45.25,32.01 49.25,34.01 34,47.26 32.75,44.26 27.5,61.01 49.75,43.51 22.5,66.01 4.25,71.76 9,70.26 28.5,56.26 2,69.26 16.5,65.76 11.75,60.51 37.25,54.26 55.5,49.01 50.25,71.26 56,68.26 37.25,61.01 37.25,71.26 28,71.26 36,74.26 36.75,1.76 35.5,10.01 46,12.51 22.5,11.76 19.75,55.01 19.75,49.51 14.25,55.01 17.5,19.76 20.75,20.76 36,36.76 58,8.01 37.5,13.76 49,12.51 22.5,69.76 28.5,39.26 2.5,57.26 20.25,9.01 2,40.26 49.5,48.51 44.25,48.76 52.25,57.51 57.75,58.01 47.25,64.01 45.25,36.76 32,49.26 28,51.51 46.75,24.51 49.75,40.01 10,77.76 10.4,2.16 28.5,42.76 32.75,2.26 28.25,4.76
  pour Top (isolate 0.4): 0.5,79.76 59.5,79.76 59.5,0.76 0.5,0.76 0.5,37.26 18,37.26 18,26.26 29.5,26.26 29.5,37.51 0.5,37.51
  pour Bottom (isolate 0.406): 0.5,79.76 59.5,79.76 59.5,0.76 0.5,0.76
J1_ACHSE_X  (via drill 0.4)
  Top 0.254: U1.13 26,24.51 v25.75,24.26 | X2.1 7.8,68.71 6,70.51 v6,71.76
  Bottom 0.254: v25.75,24.26 25.25,24.76 17.25,24.76 15,22.51 10.25,22.51 5.5,27.26 5.5,52.51 5,53.01 5,65.26 4.75,65.51 4.75,70.51 v6,71.76
J1_ACHSE_Y  (via drill 0.4)
  Top 0.254: U1.14 26.5,24.66 26.75,24.41 v26.75,23.51 | v5.75,66.01 8.2,66.01 X2.3
  Bottom 0.254: v26.75,23.51 26.75,24.76 26.25,25.26 17,25.26 14.75,23.01 10.5,23.01 6,27.51 6,53.01 5.5,53.51 5.5,65.76 v5.75,66.01
J1_TOTMANN  (via drill 0.4)
  Top 0.254: X2.7 8.04,60.97 v10.3,58.71 | U1.27 32.25,33.26 33,34.01 33,37.26 30.05,40.21 30.05,46.06 31,47.01 v31,50.51
  Bottom 0.254: v10.3,58.71 23.3,58.71 31,51.01 v31,50.51
J1_X_NULLPOS  (via drill 0.4)  (1 unrouted)
  Top 0.254: U1.16 27.5,25.51 27.75,25.26 v28.5,25.26 | v10.8,67.36 2.9,67.36 arc46 3,67.26 3,67.51
  Bottom 0.254: v28.5,25.26 27.5,26.26 16.25,26.26 16,26.01 12.75,26.01 12,25.26 9.75,25.26 7,28.01 7,52.76 7.5,53.26 7.5,54.51 6,56.01 6,64.26 9.1,67.36 v10.8,67.36
J1_Y_NULLPOS  (via drill 0.4)
  Top 0.254: U1.12 25.5,25.26 24.75,24.51 24.75,23.76 v25.5,23.01 | v2.25,71.76 0.75,70.26 0.75,66.01 1.86,64.9 X2.4
  Bottom 0.254: v25.5,23.01 24.25,24.26 17.5,24.26 15.25,22.01 10,22.01 5,27.01 5,52.01 4.5,52.51 4.5,64.76 4.25,65.01 4.25,69.76 3.75,70.26 v2.25,71.76
J2_ACHSE_X  (via drill 0.4)
  Top 0.254: U1.15 27,25.01 v27.75,24.26 | v6.5,54.01 7.55,52.71 X3.1
  Bottom 0.254: v27.75,24.26 27.75,24.76 26.75,25.76 16.5,25.76 16.25,25.51 13,25.51 12.25,24.76 9.5,24.76 6.5,27.76 v6.5,54.01
J2_ACHSE_Y  (via drill 0.4)
  Top 0.254: U1.9 24,22.76 v24.5,22.26 | v2.75,55.01 3.75,55.01 5.75,53.01 5.75,51.26 6.75,50.26 7.95,50.26 X3.3
  Bottom 0.254: 3,54.76 v2.75,55.01 4,53.76 4,52.01 4.25,51.76 4.5,51.51 4.5,26.76 9.75,21.51 15.5,21.51 17.75,23.76 23.25,23.76 24.5,22.51 v24.5,22.26
J2_TOTMANN  (via drill 0.4)
  Top 0.254: X3.7 10.43,45.09 v10.5,45.01 | U1.29 32,34.26 32.5,34.76 32.5,36.76 29.45,39.81 29.45,43.66 v29.2,43.91
  Bottom 0.254: v10.5,45.01 11,44.51 28.6,44.51 v29.2,43.91
J2_X_NULLPOS  (via drill 0.4)
  Top 0.254: U1.8 23.5,21.51 v24,21.01 | v2.15,53.01 2.15,51.86 2.96,51.55 X3.2
  Bottom 0.254: v24,21.01 23.5,21.51 23.5,22.51 22.75,23.26 18,23.26 15.75,21.01 9.5,21.01 4,26.51 4,50.76 4,51.01 v2.15,53.01
J2_Y_NULLPOS  (via drill 0.4)
  Top 0.254: v1.5,54.01 3.75,54.01 5.15,52.61 5.15,49.91 4.13,48.9 X3.4 | U1.4 21.5,25.01 20.5,24.01 v20.5,22.26
  Bottom 0.254: v1.5,54.01 1.25,53.76 1.25,52.01 1.5,51.76 3.5,49.76 3.5,26.26 9.25,20.51 16,20.51 18.25,22.76 20,22.76 v20.5,22.26
J3_ACHSE_X
  Top 0.254: U1.38 25,42.01 22.5,44.51 14.25,44.51 9.75,40.01 9.75,37.26 9.2,36.71 X4.1
J3_ACHSE_Y
  Top 0.254: U1.39 24.5,41.76 24.25,42.01 22.25,44.01 14.5,44.01 10.25,39.76 10.25,34.76 9.75,34.26 9.65,34.17 X4.3
J3_TOTMANN  (via drill 0.4)
  Top 0.254: X4.7 8.88,29.09 v9.8,30.01 | U1.30 31.1,34.76 v31.6,35.26
  Bottom 0.254: v9.8,30.01 9.8,30.26 8.5,31.56 8.5,36.26 10,37.76 31,37.76 31.6,37.16 v31.6,35.26
J3_X_NULLPOS  (via drill 0.4)  (1 unrouted)
  Top 0.254: U1.48 20,38.26 v19.45,38.81 | 1.68,35.44 X4.2 | 3,35.51 4.5,35.51 4.5,39.01 6,40.51 8,40.51 9.5,42.01 v9.5,42.76
  Bottom 0.254: v19.45,38.81 13.2,38.81 9.5,42.51 v9.5,42.76
J3_Y_NULLPOS  (via drill 0.4)
  Top 0.254: X4.4 3.63,32.9 3.75,33.01 4.5,33.01 5.25,33.76 5.25,38.76 6.5,40.01 8.25,40.01 10.7,42.46 v10.75,43.01 | U1.44 22,39.81 v21.6,40.21
  Bottom 0.254: v21.6,40.21 21.5,39.96 21.3,39.76 14,39.76 v10.75,43.01
J4_ACHSE_X
  Top 0.254: U1.45 21.5,39.01 20.25,40.26 13,40.26 11.75,39.01 11.75,25.51 9,22.76 9,20.71 | X5.1 9,20.71 | 9,20.71 9.2,20.71
J4_ACHSE_Y  (via drill 0.4)  (1 unrouted)
  Top 0.254: v10.6,18.16 8,18.16 | U1.1 20,25.01 19.5,24.51 v19.5,21.51
  Bottom 0.254: v19.5,21.51 17.75,21.51 14.75,18.51 10.95,18.51 v10.6,18.16
J4_TOTMANN  (via drill 0.4)
  Top 0.254: U1.31 30.5,35.26 30.75,35.51 30.75,36.76 v30.7,36.76 | X5.7 8.72,13.09 10.65,15.01 12.5,15.01 13.15,15.66 13.15,16.61 12.75,17.01 12.75,18.76 11.5,20.01 11.5,23.76 12.75,25.01 12.75,27.31 v13.1,27.66
  Bottom 0.254: v13.1,27.66 11,29.76 11,30.26 9,32.26 9,35.51 10.5,37.01 30.45,37.01 v30.7,36.76
J4_X_NULLPOS
  Top 0.254: U1.40 24,41.51 22,43.51 14.75,43.51 10.75,39.51 10.75,26.01 8,23.26 6,23.26 4.25,21.51 4.25,19.76 3.75,19.76 3.42,19.44 X5.2
J4_Y_NULLPOS  (via drill 0.4)
  Top 0.254: U1.36 26,43.01 v25.45,43.56 | X5.4 2.85,17.01 1,17.01 0.75,17.26 0.75,20.51 4,23.76 7.75,23.76 9.75,25.76 v9.75,27.51
  Bottom 0.254: v25.45,43.56 25.1,43.91 9.15,43.91 8,42.76 8,29.26 v9.75,27.51
JTAG_!TRST  (via drill 0.4)
  Top 0.254: R13.1 54.86,32.76 JP1.3 | U1.20 31.1,29.76 31.25,29.91 v31.25,29.86
  Bottom 0.254: v31.25,29.86 31.5,29.76 53,29.76 53.5,30.26 53.5,32.01 54.25,32.76 54.86,32.76 JP1.3
JTAG_RTCK  (via drill 0.4)
  Top 0.254: U1.24 30.5,31.76 v31,32.26 | JP1.11 52.74,22.55 R10.2
  Bottom 0.254: JP1.11 56.2,23.84 56.2,28.26 55.6,28.86 54.4,28.86 54.25,29.01 30.5,29.01 30,29.51 30,31.26 v31,32.26
JTAG_TCK  (via drill 0.4)
  Top 0.254: U1.56 16,32.26 v15,33.26 | R11.2 54.08,24.26 JP1.9
  Bottom 0.254: 52,28.01 51.99,28.01 | 51.99,28.01 JP1.9 | v15,33.26 16,32.26 16.5,32.26 20.5,28.26 29.35,28.26 29.6,28.01 51.99,28.01
JTAG_TDI  (via drill 0.4)
  Top 0.254: U1.60 16.5,30.26 v16,30.76 | v51.75,26.26 51.85,26.36 55.5,26.36 56.2,27.06 56.2,28.88 JP1.5 54.32,30.76 R12.1
  Bottom 0.254: v51.75,26.26 50.5,27.51 29.2,27.51 28.95,27.76 20,27.76 17,30.76 v16,30.76
JTAG_TDO  (via drill 0.4)
  Top 0.254: R15.1 54.66,20.26 JP1.13 | U1.64 18.05,28.21 v18.5,27.76
  Bottom 0.254: v18.5,27.76 19,27.26 28.6,27.26 28.85,27.01 49.5,27.01 52.25,24.26 52.25,22.51 54.75,20.01 JP1.13
JTAG_TMS  (via drill 0.4)
  Top 0.254: U1.52 17,34.26 v16.25,33.51 | R14.1 53.78,28.76 JP1.7
  Bottom 0.254: v16.25,33.51 21,28.76 29.75,28.76 30,28.51 54.05,28.51 54.9,27.66 JP1.7
N$1
  Top 0.254: U2.30 22.55,53.46 23,53.01 23.25,53.01 | R1.1 25.45,54.46 24.5,53.51 24.25,53.26 24,53.01 23.25,53.01 | 23.25,53.01 23.05,53.01 C2.1 23.2,53.06 23.25,53.01
N$2
  Top 0.254: C1.1 15.8,61.61 U2.6
N$3
  Top 0.254: 15.3,7.46 16.81,5.95 IC1.8 | 15.5,7.25 15.3,7.46 | 15.3,7.46 15.3,11.46 13.25,13.51 12.24,13.51 IC1.1
N$4
  Top 0.254: JP1.19 54.91,9.9 R9.2
N$5
  Top 0.61: C20.1 49.2,78.51 47,78.51 46,77.51 X1.1 | PWS1.24 57.97,51.23 57.75,51.01 55.75,51.01 55.5,51.26 55.5,53.56 PWS1.23 55.43,62.58 44.5,73.51 44.5,75.26 46,76.76
  Top 0.813: 46,76.76 X1.1
N$6
  Top 0.254: U1.49 18,35.76 17.5,35.76 17,36.26 17,37.76 17,37.86 C6.1
N$7
  Top 0.254: D1.1 10.19,5.45 10.25,5.51 10.2,5.51 R4.2 9.75,5.96 R3.2 9.52,7.58 T1.1
N$8
  Top 0.254: JP1.17 54.5,14.51 54,14.01 52.4,14.01 R8.2
N$9
  Top 0.254: U1.62 16.5,29.26 arc90 14,26.76 13.75,24.61 Q2.1 13.44,24.14 14,24.08 14,20.76 14.29,20.47 C7.1
N$10
  Top 0.254: U1.61 14.25,29.76 arc45 14.23,29.75 Q2.2 13.46,29.23 C8.1
N$12  (1 unrouted)
  Top 0.254: U2.28 25.6,51.86 arc90 26.5,52.76
N$13
  Top 0.254: U2.27 23.29,51.06 arc-90 Q1.1
N$14
  Top 0.254: R16.1 12,64.76 14.5,67.26 17,67.26 18.8,69.06 X6.2
N$15  (via drill 0.4)
  Top 0.254: v19,66.76 15.75,66.76 14,65.01 R17.1 | v18,69.76 X6.3
  Bottom 0.254: v19,66.76 18,67.76 v18,69.76
N$16  (via drill 0.4)
  Top 0.254: U2.7 15,60.56 | 15,60.56 R17.2 | 15,60.56 14.8,60.76 v14.5,60.76 | R18.1 v19.35,64.46
  Bottom 0.254: v19.35,64.46 15.65,60.76 v14.5,60.76
N$17
  Top 0.254: U2.8 14.2,59.56 12,61.76 12,62.01 R16.2
N$18
  Top 0.254: U2.5 16.6,60.86 17.25,61.51 18,62.26 R18.2
N$19
  Top 0.254: U2.32 21.3,57.81 26.5,63.01 26.5,77.26 27,77.76 33.25,77.76
  Top 0.305: 33.25,77.76 33.38,77.64 | 33.38,77.64 33.5,77.51 | U3.1 33.38,77.64
N$20
  Top 0.254: U2.1 19.8,57.26 26,63.46 26,77.76 26.65,78.41 35,78.41 35.25,78.16 35.25,77.01 34.65,76.41 33.41,76.41 U3.2
N$21
  Top 0.254: U2.2 19,57.26 25.5,63.76 25.5,78.26 26.15,78.91 35.5,78.91 36,78.41 36,76.26 35,75.26 33.77,75.26 U3.3 31.89,75.13 31.3,75.71 R19.2
N$22
  Top 0.254: R20.1 R19.1 33.35,73.81 U3.4
N$23
  Top 0.61: J1.3 43.5,51.55 43.5,55.51 42.5,56.51 31,56.51 30.03,55.54 PWS1.13
N$24
  Top 0.254: IC1.12 16.78,11.03 16.75,11.01 16.75,10.01 17,9.76 IC1.11
N$26  (via drill 0.4)
  Top 0.254: 12.14,12.26 IC1.2 10.86,12.3 10.65,12.51 10.65,14.11 10.95,14.41 14.9,14.41 15.85,15.36 15.85,27.66 v15.5,28.01 | U1.57 15.25,31.76 v14.75,31.26
  Bottom 0.254: v14.75,31.26 14.75,29.76 15.5,29.01 v15.5,28.01
N$27  (via drill 0.4)
  Top 0.254: U1.46 21,38.76 20,39.76 13.25,39.76 12.25,38.76 12.25,25.26 11,24.01 11,19.76 12.25,18.51 v12.25,16.01 | v16,12.26 16,9.51 17,8.51 18.3,8.51 IC1.10
  Bottom 0.305: v16,12.26 v12.25,16.01
N$28
  Top 0.813: CF1.1 J1.2
N$29
  Top 0.254: C22.2 39.2,21.81 40.25,20.76 41.83,20.76 IC2.3
N$30
  Top 0.254: IC2.1 39.8,23.21 39.5,23.51 39.2,23.51 C22.1
N$31
  Top 0.254: IC2.4 39.31,19.4 C23.1
N$32
  Top 0.254: IC2.5 39.31,18.13 C23.2
N$33
  Top 0.254: C25.2 42.95,25.06 43.5,24.51 43.75,24.26 43.75,22.26 43.5,22.01 42,22.01 IC2.2
N$34
  Top 0.254: IC2.6 40.59,16.86 40,16.26 39.75,16.01 39.3,16.01 C26.1
N$35  (via drill 0.4)
  Top 0.305: IC2.14 46.09,20.67 v46,20.66
  Bottom 0.305: v46,20.66 46.09,20.67 46.8,20.67 47,20.47 47,15.46 46.95,15.46 39.74,8.26 X7.2
N$36  (via drill 0.4)
  Top 0.305: IC2.13 46.13,19.4 v46,19.26
  Bottom 0.305: v46,19.26 46,15.51 40.25,9.76 38.58,9.76 X7.3
N$37  (via drill 0.4)
  Top 0.254: 8.29,4.05 D1.2 8.29,2.55 v7.5,1.76 | T2.1 13.65,4.41 v14.5,5.26 | R6.2 4,9.26 v4.75,10.01 | R7.2 v21,5.01
  Bottom 0.254: 15.15,4.01 15.15,4.51 v14.5,5.26 14.5,8.26 13.7,9.06 5.45,9.06 4.75,9.76 v4.75,10.01 | 15.15,4.01 20,4.01 v21,5.01 | v7.5,1.76 8.1,1.16 12.4,1.16 15.15,4.01
N$38  (via drill 0.4)
  Top 0.254: C27.1 9,72.26 11,72.26 | 11,72.26 R21.1 | 11,72.26 X6.M4
  Top 0.813: X6.M3 22.5,72.56 v22.5,74.76 22.5,77.26 X6.M2 | X6.M1 13.6,77.36 v13.6,74.66 13.6,72.46 X6.M4
  Bottom 0.813: v22.5,74.76 22.5,71.26 13.8,71.26 13.6,71.46 v13.6,74.66
NET_P0.14  (via drill 0.4)
  Top 0.254: U1.41 23.5,41.26 21.75,43.01 15,43.01 11.25,39.26 11.25,25.76 8.25,22.76 6.5,22.76 5.75,22.01 5.75,12.01 v6.25,11.51 | v11.8,1.96 12.5,1.76 T2.3 13.64,2.81 14.3,2.81 14.75,3.26 14.89,3.26 R5.1
  Bottom 0.254: v6.25,11.51 4,11.51 3.25,10.76 3.25,8.81 3.6,8.46 10.4,8.46 11.5,7.26 11.5,2.31 11.8,2.01 v11.8,1.96
REF_3V
  Top 0.254: U1.63 17.25,28.76 arc90 16.5,28.01 16.5,26.96 arc90 C5.1 | C30.1 18.55,19.01
  Top 0.305: REF1.6 22.86,18.15 21.75,19.26 C28.+ 21,19.01 18.55,19.01 | C5.1 17.2,26.51 18.25,26.51 18.5,26.26 18.5,18.71 C30.1
RTS  (1 unrouted)
  Top 0.254: X7.7 34.59,1.56 34.29,1.26 21.25,1.26 21,1.51 20.75,1.76
RTS1  (1 unrouted)
  Top 0.254: U1.35 26.5,43.76 24.75,45.51 20.75,45.51 19,47.26 19,48.01
RXD
  Top 0.254: U1.21 30.4,30.26 30.9,30.76 31.75,30.76 32.1,30.41 32.1,27.91 | IC2.12 45.13,18.13 45,18.26 44.75,18.51 44.75,26.26 43.5,27.51 32.5,27.51 | 32.5,27.51 32.1,27.91 | 32.1,27.91 32.5,27.51
RXD1
  Top 0.254: U1.34 27,44.01 25,46.01 21.25,46.01 19.8,47.46 U2.24
TXD
  Top 0.254: U1.19 30.5,29.26 31,28.76 31,28.26 32.25,27.01 43.25,27.01 43.75,26.51 44,26.26 44.25,26.01 44.25,18.01 45.25,17.01 45.41,16.86 IC2.11
TXD1
  Top 0.254: U2.25 21.5,49.26 21.5,46.76 21.75,46.51 25.25,46.51 27.5,44.26 27.5,37.76 U1.33
USB_POWER_IN  (via drill 0.4)
  Top 0.61: X6.1 v19.6,68.36
  Bottom 0.61: J1.1 48.5,51.55 48.5,59.26 39.4,68.36 v19.6,68.36
USER_STOP_BUTTON  (via drill 0.4)
  Top 0.254: IC1.13 20.49,12.3 C19.1 20.7,12.51 21.25,12.51 22.25,13.51 | R22.2 22.45,13.71 22.25,13.51 | v43.5,30.76 45.3,28.96 45.3,22.36 v45.7,21.96 | v24,12.26 22.75,13.51 22.25,13.51
  Bottom 0.254: X8.1 52,43.03 52,32.26 50.5,30.76 v43.5,30.76 | v45.7,21.96 45,21.26 45,15.76 41.5,12.26 v24,12.26

### Text on the board
Reference: Внимание: при монтаже выводных компонентов / методом волновой пайки - наклеить защитную / плёнку в указанных местах.